# EAGLE design schema (EAGLE 6.6.0)
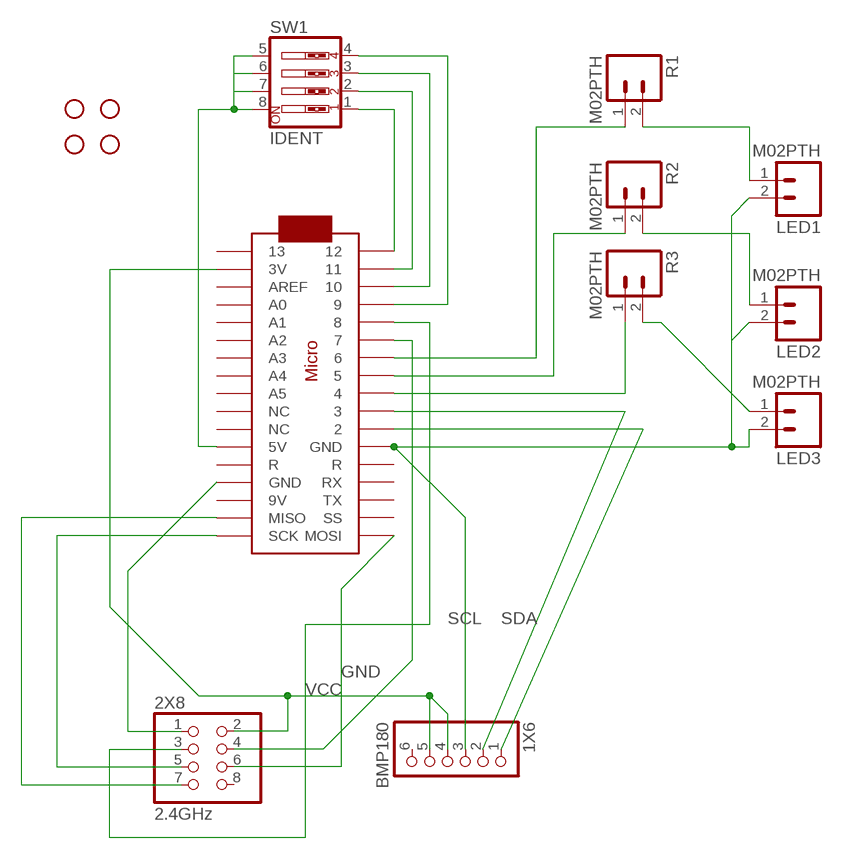
[diagram p0: schematic, sheet 1]

## Parts
1X6  BMP180  PINHD-1X6  [1X06]
2X8  2.4GHz  PINHD-2X4  [2X04]
LED1  M02PTH  [1X02]
LED2  M02PTH  [1X02]
LED3  M02PTH  [1X02]
R1  M02PTH  [1X02]
R2  M02PTH  [1X02]
R3  M02PTH  [1X02]
STANDOFF1  STAND-OFF  [STAND-OFF]
STANDOFF2  STAND-OFF  [STAND-OFF]
STANDOFF3  STAND-OFF  [STAND-OFF]
STANDOFF4  STAND-OFF  [STAND-OFF]
SW1  IDENT  SW_DIP-4  [EDG-04]
U$1  ARDUINOMICRO  [ARDUINOMICRO]

## Nets
GND: 1X6.3 2X8.1 LED1.2 LED2.2 LED3.2 U$1.P$12(GND) U$1.P$21(GND)
N$1: R3.1 U$1.P$9
N$2: 2X8.3 U$1.P$5
N$3: 2X8.4 U$1.P$6
N$4: LED1.1 R1.2
N$5: LED2.1 R2.2
N$6: LED3.1 R3.2
N$7: 2X8.5 U$1.P$18(SCK)
N$8: R2.1 U$1.P$8
N$9: 2X8.6 U$1.P$17(MOSI)
N$10: 2X8.7 U$1.P$19(MISO)
N$11: R1.1 U$1.P$7
N$12: SW1.5 SW1.6 SW1.7 SW1.8 U$1.P$23(5V)
N$13: SW1.1 U$1.P$1
N$14: SW1.2 U$1.P$2
N$15: SW1.3 U$1.P$3
N$16: SW1.4 U$1.P$4
SCL: 1X6.2 U$1.P$10
SDA: 1X6.1 U$1.P$11
VCC: 1X6.4 1X6.5 2X8.2 U$1.P$33(3V)
Unconnected: 1X6.6 2X8.8 U$1.P$13(R) U$1.P$14(RX) U$1.P$15(TX) U$1.P$16(SS) U$1.P$20(9V) U$1.P$22(R) U$1.P$24(NC) U$1.P$25(NC) U$1.P$26(A5) U$1.P$27(A4) U$1.P$28(A3) U$1.P$29(A2) U$1.P$30(A1) U$1.P$31(A0) U$1.P$32(AREF) U$1.P$34

## Library data of the parts
1X6 = adafruit:PINHD-1X6: PIN HEADER
2X8 = adafruit:PINHD-2X4: PIN HEADER
LED1-LED3 R1-R3 = SparkFun-Connectors:M02: Standard 2-pin 0.1" header. Use with - straight break away headers ( PRT-00116) - right angle break away headers (PRT-00553) - swiss pins (PRT-00743) - machine pins (PRT-00117) - female headers (PRT-00115) Molex polarized connector foot print use with: PRT-08233 with associated crimp pins and housings. 2.54_SCREWTERM for use with PRT-10571. 3.5mm Screw Terminal footprints for PRT-08084 5mm Screw Terminal footprints for use with PRT-08432
STANDOFF1-STANDOFF4 = SparkFun-Electromechanical:STAND-OFF: #4 Stand Off This is the mechanical footprint for a #4 phillips button head screw. Use the keepout ring to avoid running the screw head into surrounding components. SKU : PRT-00447
SW1 = special:SW_DIP-4: DIP SWITCH
U$1 = adafruit:ARDUINOMICRO

## Board
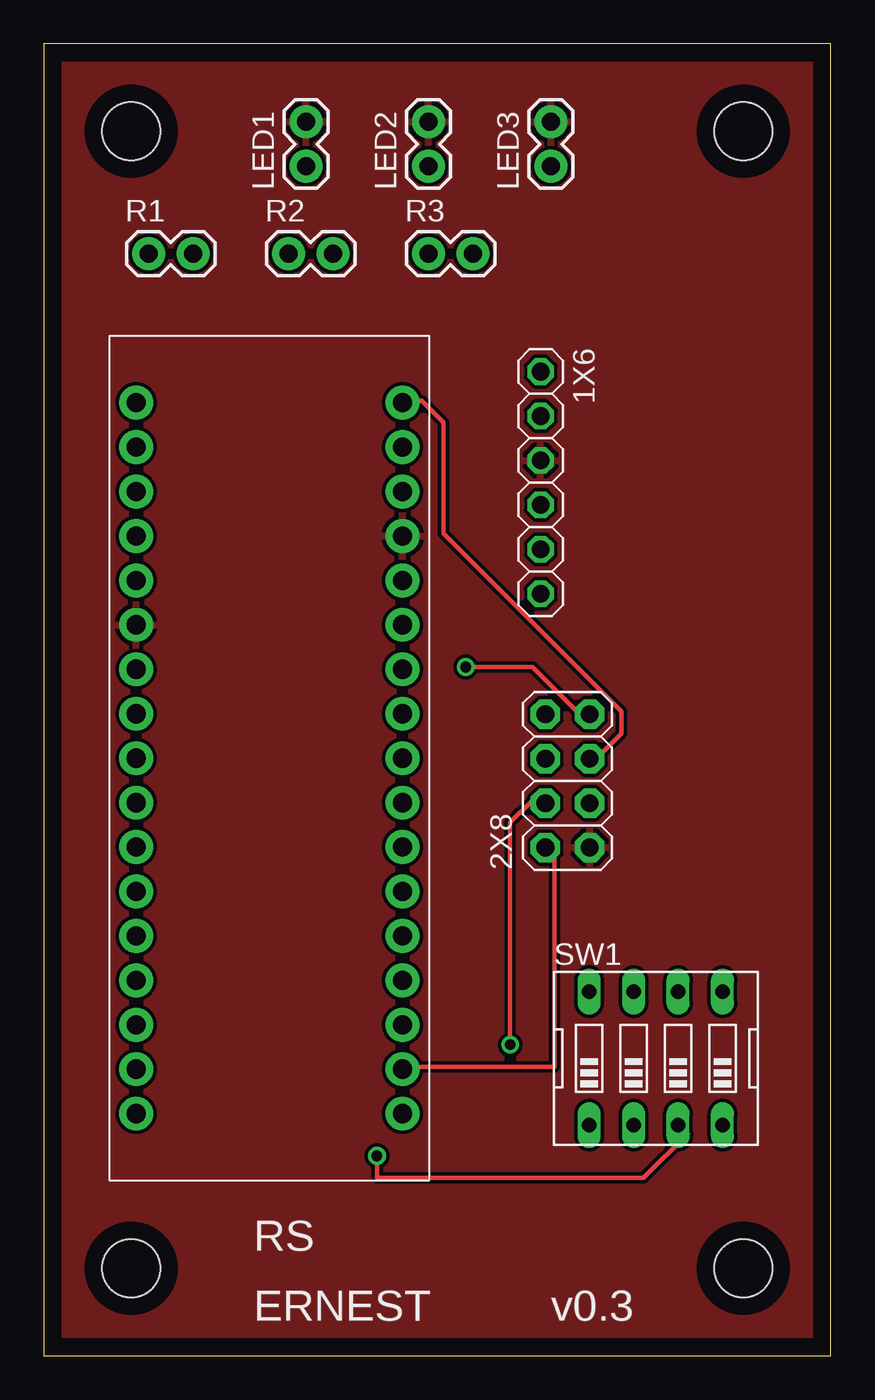
[diagram p1: board, top side]
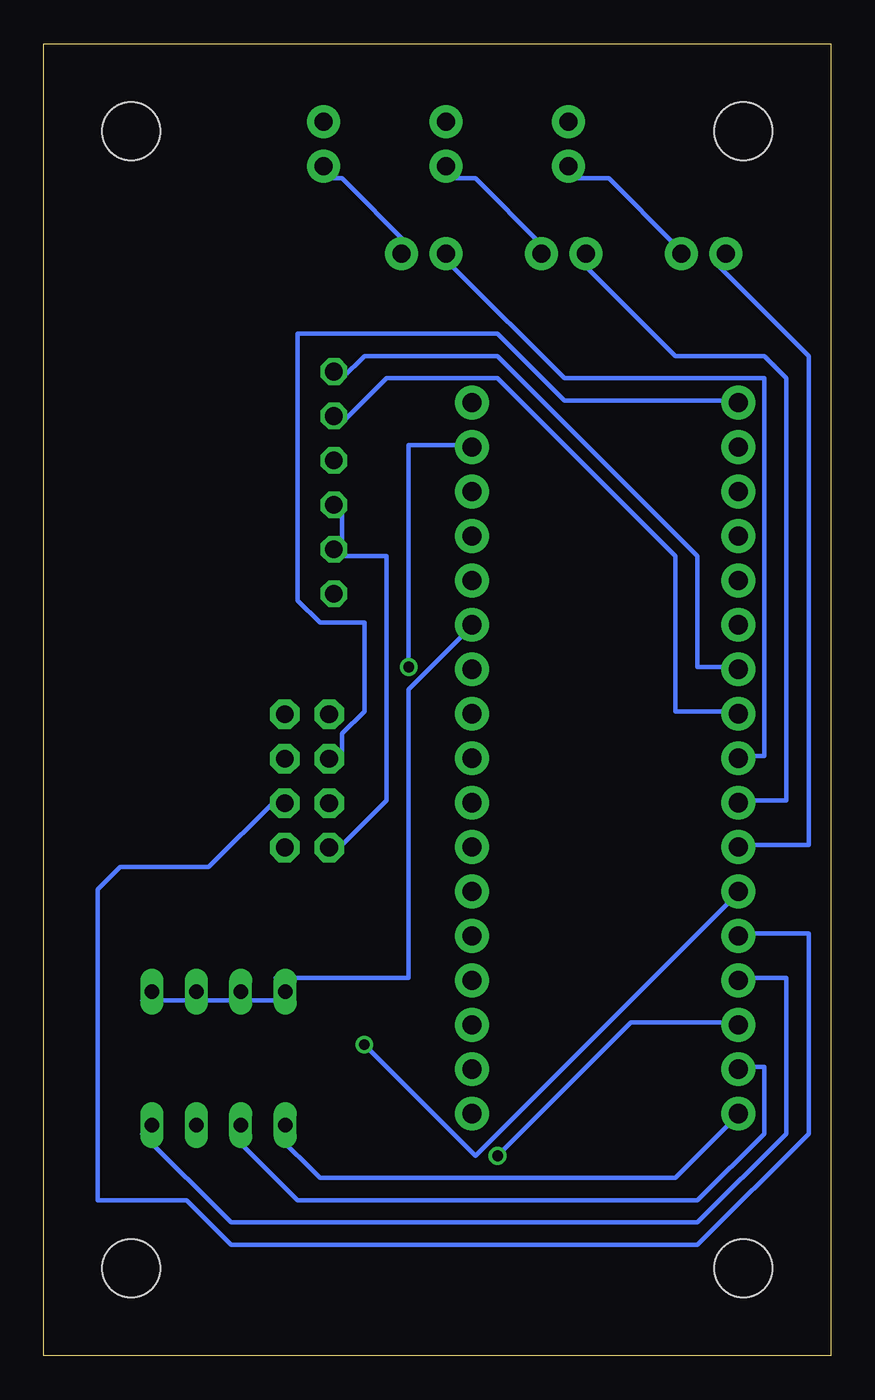
[diagram p2: board, bottom side, seen from below]

Size 45 x 75 mm. Coordinates in mm from the lower left corner, seen from the top.
Outline: 0,0 45,0 45,75 0,75 0,0
Copper layers (1*16): Top 0.035mm / dielectric 1.5mm / Bottom 0.035mm
Design rules "default": minimum track width 10mil, minimum drill 24mil, track to track 8mil, track to pad 8mil, pad to pad 8mil, via to via 8mil, smd to smd 8mil, copper to edge 40mil, drill to drill 8mil, minimum pad ring 10mil, minimum via ring 8mil, stop-mask expansion 4mil, vias tented up to drill 0mil, thermal gap 10mil

### Footprints (pad centres in the part's own frame; a part is rotated, then mirrored left to right if it is on the bottom)
1X06 = drill 1.016 octagon: 1 -6.35,0; 2 -3.81,0; 3 -1.27,0; 4 1.27,0; 5 3.81,0; 6 6.35,0
2X04 = drill 1.016 pad 1.676 octagon: 1 -3.81,-1.27; 2 -3.81,1.27; 3 -1.27,-1.27; 4 -1.27,1.27; 5 1.27,-1.27; 6 1.27,1.27; 7 3.81,-1.27; 8 3.81,1.27
1X02 = drill 1.016 pad 1.88: 1 0,0; 2 2.54,0
STAND-OFF = hole 3.302: 0,0
EDG-04 = drill 0.813 long: 1 -3.81,-3.81; 2 -1.27,-3.81; 3 1.27,-3.81; 4 3.81,-3.81; 5 3.81,3.81; 6 1.27,3.81; 7 -1.27,3.81; 8 -3.81,3.81
ARDUINOMICRO = drill 1.1 pad 1.93: P$1 -20.32,7.62; P$2 -17.78,7.62; P$3 -15.24,7.62; P$4 -12.7,7.62; P$5 -10.16,7.62; P$6 -7.62,7.62; P$7 -5.08,7.62; P$8 -2.54,7.62; P$9 0,7.62; P$10 2.54,7.62; P$11 5.08,7.62; P$12 12.7,-7.62; P$13 10.16,-7.62; P$14 12.7,7.62; P$15 15.24,7.62; P$16 17.78,7.62; P$17 20.32,7.62; P$18 20.32,-7.62; P$19 17.78,-7.62; P$20 15.24,-7.62; P$21 7.62,7.62; P$22 10.16,7.62; P$23 7.62,-7.62; P$24 5.08,-7.62; P$25 2.54,-7.62; P$26 0,-7.62; P$27 -2.54,-7.62; P$28 -5.08,-7.62; P$29 -7.62,-7.62; P$30 -10.16,-7.62; P$31 -12.7,-7.62; P$32 -15.24,-7.62; P$33 -17.78,-7.62; P$34 -20.32,-7.62

### Placement (x,y rotation side)
1X6  28.41,49.91 270 top
2X8  29.95,32.86 90 top
LED1  15,68 90 top
LED2  22,68 90 top
LED3  29,68 90 top
R1  6,63 0 top
R2  14,63 0 top
R3  22,63 0 top
STANDOFF1  40,70 0 top
STANDOFF2  5,70 0 top
STANDOFF3  40,5 0 top
STANDOFF4  5,5 0 top
SW1  35,17 0 top
U$1  12.9,34.16 90 top

### Tracks (layer width: path | path; a pad name or v marks a point on that pad's centre or on a via)
GND
  pour Top: 0,0 45,0 45,75 0,75
N$1
  Bottom 0.254: R3.1 21.59,62.23 15.24,55.88 3.81,55.88 3.81,34.29 5.08,34.29 U$1.P$9
N$2
  Bottom 0.254: 2X8.3 31.75,31.75 35.56,27.94 40.64,27.94 41.91,26.67 41.91,8.89 36.83,8.89 34.29,6.35 7.62,6.35 1.27,12.7 1.27,24.13 5.08,24.13 U$1.P$5
N$3  (via drill 0.61)
  Top 0.254: v26.67,17.78 26.67,30.48 27.94,31.75 2X8.4
  Bottom 0.254: v26.67,17.78 20.32,11.43 5.08,26.67 U$1.P$6
N$4
  Bottom 0.254: R1.2 8.89,63.5 12.7,67.31 15.24,67.31 LED1.1
N$5
  Bottom 0.254: R2.2 16.51,63.5 20.32,67.31 21.59,67.31 LED2.1
N$6
  Bottom 0.254: R3.2 24.13,63.5 27.94,67.31 29.21,67.31 LED3.1
N$7
  Top 0.254: 2X8.5 31.75,34.29 33.02,35.56 33.02,36.83 22.86,46.99 22.86,53.34 21.59,54.61 20.32,54.61 U$1.P$18
N$8
  Bottom 0.254: R2.1 13.97,62.23 8.89,57.15 3.81,57.15 2.54,55.88 2.54,31.75 5.08,31.75 U$1.P$8
N$9
  Bottom 0.254: 2X8.6 27.94,34.29 27.94,35.56 26.67,36.83 26.67,41.91 29.21,41.91 30.48,43.18 30.48,58.42 19.05,58.42 15.24,54.61 5.08,54.61 U$1.P$17
N$10  (via drill 0.61)
  Top 0.254: v24.13,39.37 27.94,39.37 30.48,36.83 2X8.7
  Bottom 0.254: v24.13,39.37 24.13,52.07 20.32,52.07 U$1.P$19
N$11
  Bottom 0.254: R1.1 6.35,62.23 1.27,57.15 1.27,29.21 5.08,29.21 U$1.P$7
N$12
  Bottom 0.254: 34.29,20.32 31.75,20.32 SW1.8 31.75,21.59 24.13,21.59 24.13,38.1 20.32,41.91 U$1.P$23 | 34.29,20.32 36.83,20.32 | 34.29,20.32 SW1.7 | 36.83,20.32 39.37,20.32 SW1.5 | 36.83,20.32 SW1.6
N$13
  Bottom 0.254: SW1.1 31.75,12.7 29.21,10.16 8.89,10.16 5.08,13.97 U$1.P$1
N$14
  Bottom 0.254: SW1.2 34.29,12.7 30.48,8.89 7.62,8.89 3.81,12.7 3.81,16.51 5.08,16.51 U$1.P$2
N$15  (via drill 0.61)
  Top 0.254: v19.05,11.43 19.05,10.16 34.29,10.16 36.83,12.7 SW1.3
  Bottom 0.254: v19.05,11.43 11.43,19.05 5.08,19.05 U$1.P$3
N$16
  Bottom 0.254: SW1.4 39.37,12.7 34.29,7.62 7.62,7.62 2.54,12.7 2.54,21.59 5.08,21.59 U$1.P$4
SCL
  Bottom 0.254: 1X6.2 27.94,53.34 25.4,55.88 19.05,55.88 8.89,45.72 8.89,36.83 5.08,36.83 U$1.P$10
SDA
  Bottom 0.254: 1X6.1 27.94,55.88 26.67,57.15 19.05,57.15 7.62,45.72 7.62,39.37 5.08,39.37 U$1.P$11
VCC
  Top 0.254: U$1.P$33 20.32,16.51 29.21,16.51 29.21,29.21 2X8.2
  Bottom 0.254: 27.94,45.72 27.94,48.26 1X6.4 | 27.94,45.72 25.4,45.72 25.4,31.75 27.94,29.21 2X8.2 | 27.94,45.72 1X6.5

### Text on the board
tPlace: RS | ERNEST | v0.3